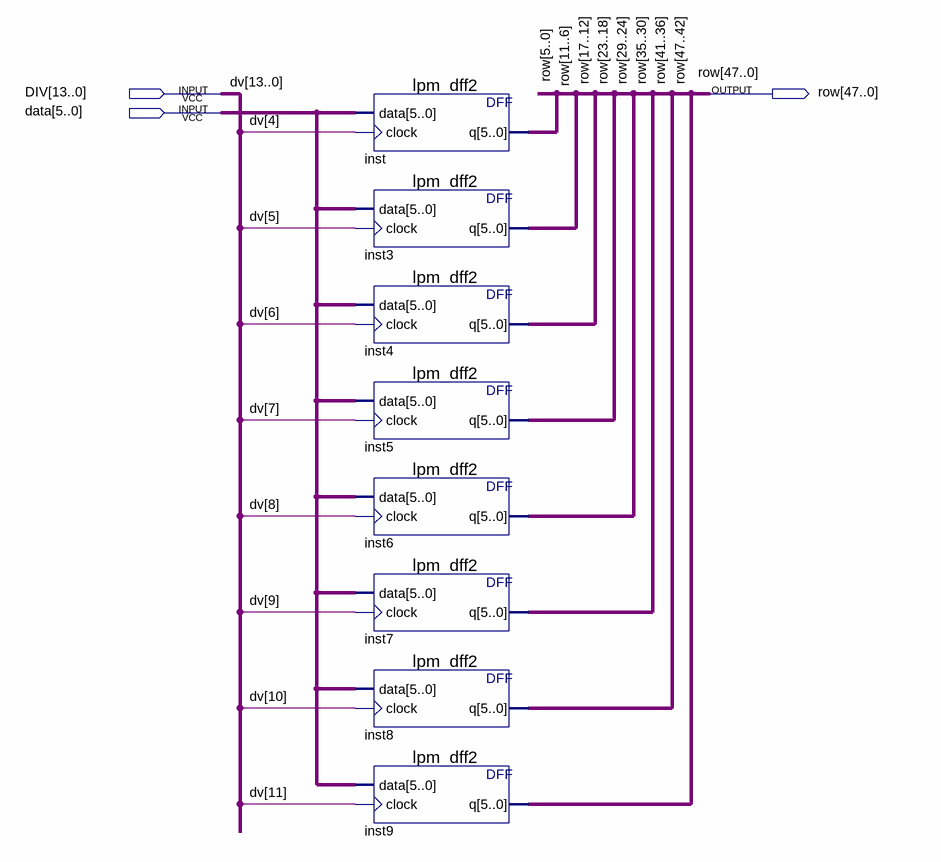
[diagram p0: schematic sheet]
// Quartus schematic Accum.bdf as structural Verilog: 8 symbols, 3 pins
module Accum (
  input  [13:0] DIV,
  input  [5:0] data,
  output [47:0] row
);

  lpm_dff2 inst (.data(data), .clock(DIV[4]), .q(row[5:0]));
  lpm_dff2 inst3 (.data(data), .clock(DIV[5]), .q(row[11:6]));
  lpm_dff2 inst4 (.data(data), .clock(DIV[6]), .q(row[17:12]));
  lpm_dff2 inst5 (.data(data), .clock(DIV[7]), .q(row[23:18]));
  lpm_dff2 inst6 (.data(data), .clock(DIV[8]), .q(row[29:24]));
  lpm_dff2 inst7 (.data(data), .clock(DIV[9]), .q(row[35:30]));
  lpm_dff2 inst8 (.data(data), .clock(DIV[10]), .q(row[41:36]));
  lpm_dff2 inst9 (.data(data), .clock(DIV[11]), .q(row[47:42]));

  // Other names for the same wires on the sheet: dv[13:0] = DIV
endmodule
